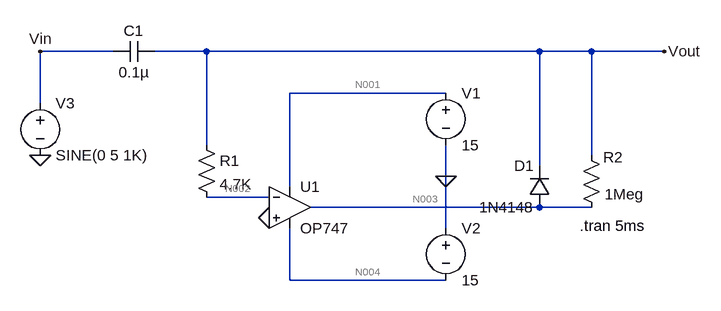
[diagram p0: schematic CLAMPER.asc]
CLAMPER.asc, the LTspice schematic file:
Version 4
SHEET 1 1584 680
WIRE -96 0 -208 0
WIRE 48 0 -32 0
WIRE 560 0 48 0
WIRE 640 0 560 0
WIRE 752 0 640 0
WIRE 416 64 176 64
WIRE -208 80 -208 0
WIRE 48 144 48 0
WIRE 640 160 640 0
WIRE 560 176 560 0
WIRE 416 192 416 144
WIRE 176 208 176 64
WIRE 144 224 48 224
WIRE 560 240 208 240
WIRE 640 240 560 240
WIRE 416 272 416 192
WIRE 176 352 176 272
WIRE 416 352 176 352
FLAG 416 192 0
FLAG -208 160 0
FLAG 144 256 0
FLAG 752 0 Vout
FLAG -208 0 Vin
SYMBOL OpAmps\\OP747 176 176 R0
SYMATTR InstName U1
SYMBOL voltage 416 48 R0
WINDOW 123 0 0 Left 0
WINDOW 39 0 0 Left 0
SYMATTR InstName V1
SYMATTR Value 15
SYMBOL voltage 416 256 R0
WINDOW 123 0 0 Left 0
WINDOW 39 0 0 Left 0
SYMATTR InstName V2
SYMATTR Value 15
SYMBOL res 32 128 R0
SYMATTR InstName R1
SYMATTR Value 4.7K
SYMBOL res 624 144 R0
WINDOW 0 34 19 Left 2
SYMATTR InstName R2
SYMATTR Value 1Meg
SYMBOL diode 576 240 R180
WINDOW 0 24 64 Left 2
WINDOW 3 24 0 Left 2
SYMATTR InstName D1
SYMATTR Value 1N4148
SYMBOL cap -32 -16 R90
WINDOW 0 0 32 VBottom 2
WINDOW 3 32 32 VTop 2
SYMATTR InstName C1
SYMATTR Value 0.1µ
SYMBOL voltage -208 64 R0
WINDOW 123 0 0 Left 0
WINDOW 39 0 0 Left 0
SYMATTR InstName V3
SYMATTR Value SINE(0 5 1K)
TEXT 622 268 Left 2 !.tran 5ms

The netlist it stands for:
* CLAMPER.asc
XU1 0 N002 N001 N004 N003 OP747  ; pins In+ In- V+ V- OUT
V1 N001 0 15
V2 0 N004 15
R1 Vout N002 4.7K
R2 Vout N003 1Meg
D1 N003 Vout 1N4148
C1 Vout Vin 0.1µ
V3 Vin 0 SINE(0 5 1K)
.model D D
.lib standard.dio
.tran 5ms
.backanno
.end

* Results of the author's LTspice run, read from the files saved beside the schematic
* Operating Point, zero values left out:
*   V(n002) = 80 µV
*   V(n004) = -15 V
*   V(n001) = 15 V
*   V(n003) = -8.39 mV
*   V(vout) = 38.38 µV
*   I(D1) = -427.7 pA
*   I(R2) = 8.429 nA
*   I(R1) = -8.856 nA
*   I(V2) = -304.4 µA
*   I(V1) = -304.4 µA
*   Ix(u1:1) = -10.86 nA
*   Ix(u1:2) = -8.856 nA
*   Ix(u1:99) = 304.4 µA
*   Ix(u1:50) = -304.4 µA
*   Ix(u1:45) = 8.856 nA
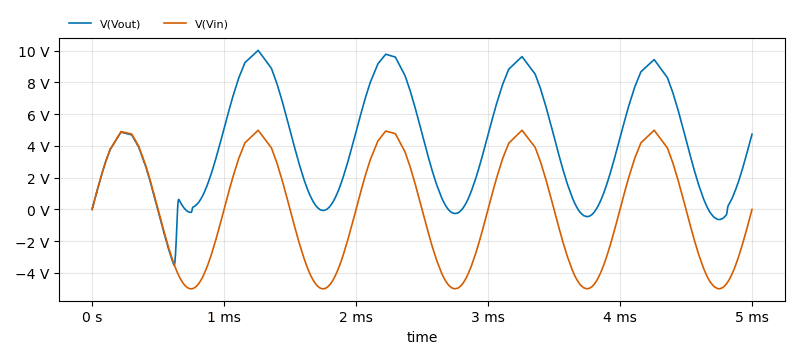
[diagram p1: Transient Analysis of CLAMPER.asc, plotted from the saved traces]
* Transient Analysis, 1 run:
*   V(Vout): min -3.513 V, max 10.02 V, average 4.098 V, rms 5.408 V, last 4.739 V
*   V(Vin): min -5 V, max 4.99 V, average -27.8 mV, rms 3.51 V, last 0 V